# Altium project 定位NBIOT.PrjPCB
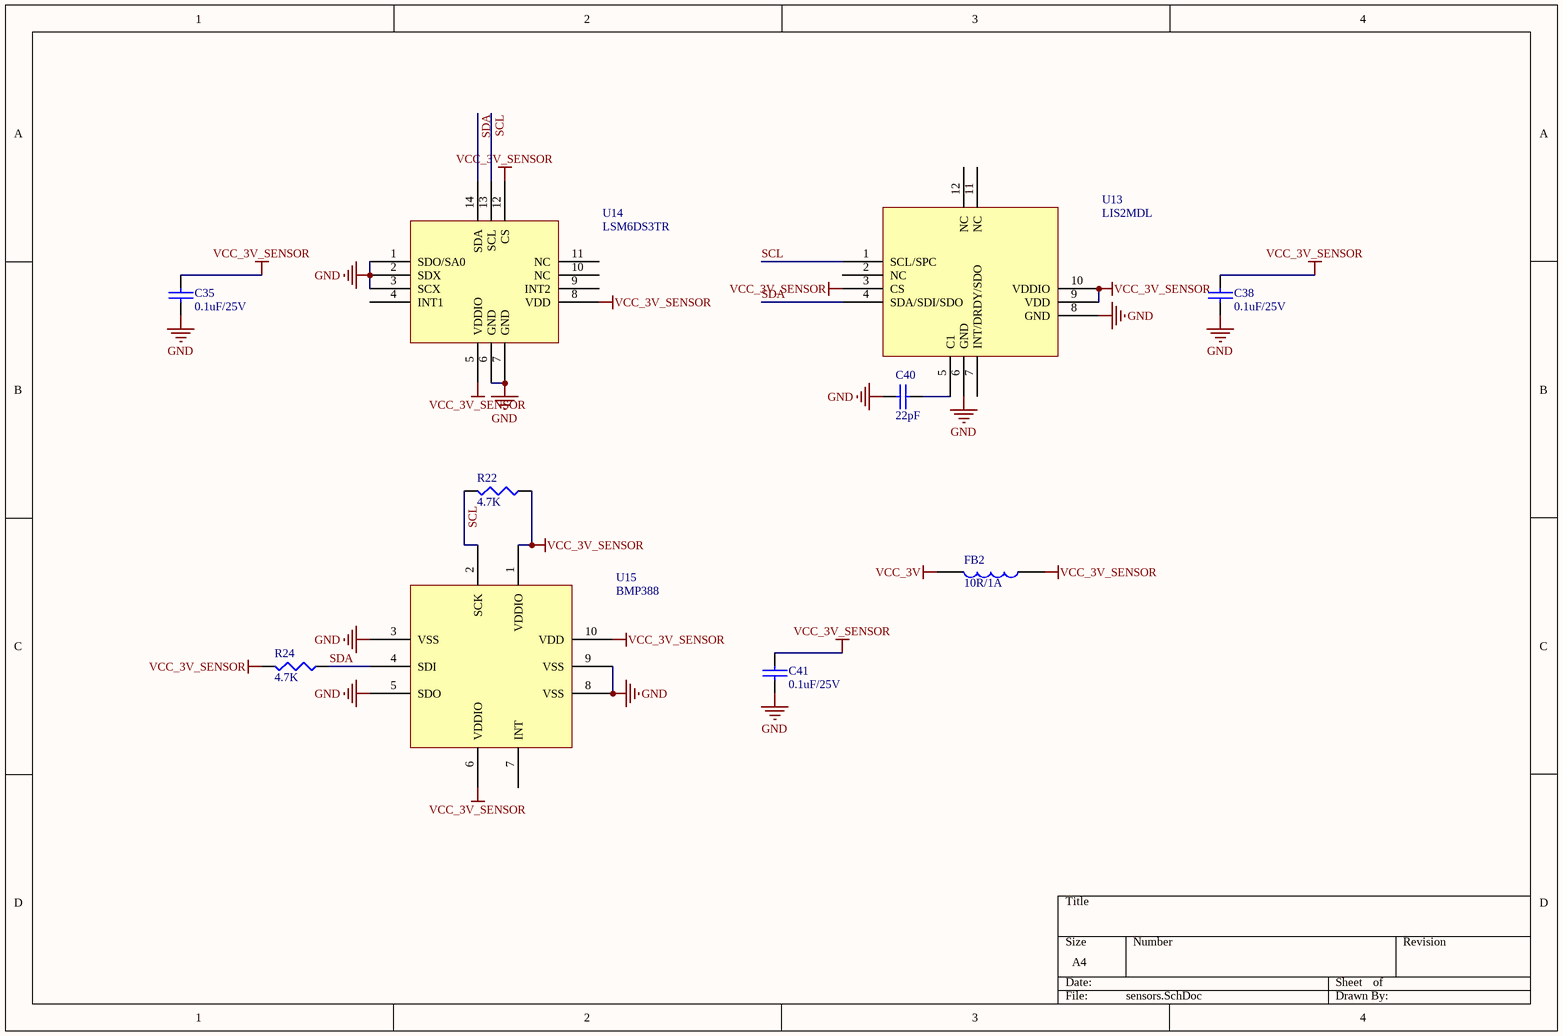
[diagram p0: sensors.SchDoc]
5 sheets, 117 parts. Net scope: global (net labels, ports and power ports of the same name join across sheets).
Board file: PCB1.2.PcbDoc
Sheets:
  sensors.SchDoc
  power.SchDoc
  4G.SchDoc
  GPS&&lte2.SchDoc
  NBIOT.SchDoc

## Sheet sensors.SchDoc
size A4

### Parts
C35  0.1uF/25V  [0402C]
C38  0.1uF/25V  [0402C]
C40  22pF  [0402c]
C41  0.1uF/25V  [0402C]
FB2  10R/1A  [0603R]
R22  4.7K  [0402R]
R24  4.7K  [0402R]
U13  LIS2MDL  [LIS2MDL]
U14  LSM6DS3TR  [LSM6DS3TR-C]
U15  BMP388  [BMP388]

### Nets
GND: C35.1 C38.1 C40.2 C41.1 U13.6(GND) U13.8(GND) U14.1(SDO/SA0) U14.2(SDX) U14.3(SCX) U14.6(GND) U14.7(GND) U15.3(VSS) U15.5(SDO) U15.8(VSS) U15.9(VSS)
VCC_3V: FB2.1
VCC_3V_SENSOR: C35.2 C38.2 C41.2 FB2.2 R22.1 R24.2 U13.3(CS) U13.9(VDD) U13.10(VDDIO) U14.5(VDDIO) U14.8(VDD) U14.12(CS) U15.1(VDDIO) U15.6(VDDIO) U15.10(VDD)
SCL: R22.2 U13.1(SCL/SPC) U14.13(SCL) U15.2(SCK)
SDA: R24.1 U13.4(SDA/SDI/SDO) U14.14(SDA) U15.4(SDI)
NetC40_1: C40.1 U13.5(C1)

Not connected (* = marked no-connect by the designer): U13 2(NC) 7(INT/DRDY/SDO) 11(NC) 12(NC); U14 4(INT1) 9(INT2) 10(NC) 11(NC); U15 7(INT)

### Library data of the parts
C35 C38 C40 C41 = CAP: Capacitor
FB2 = INDUCTOR1
R22 R24 = RES1: P: 1/8W

## Sheet power.SchDoc
size A3
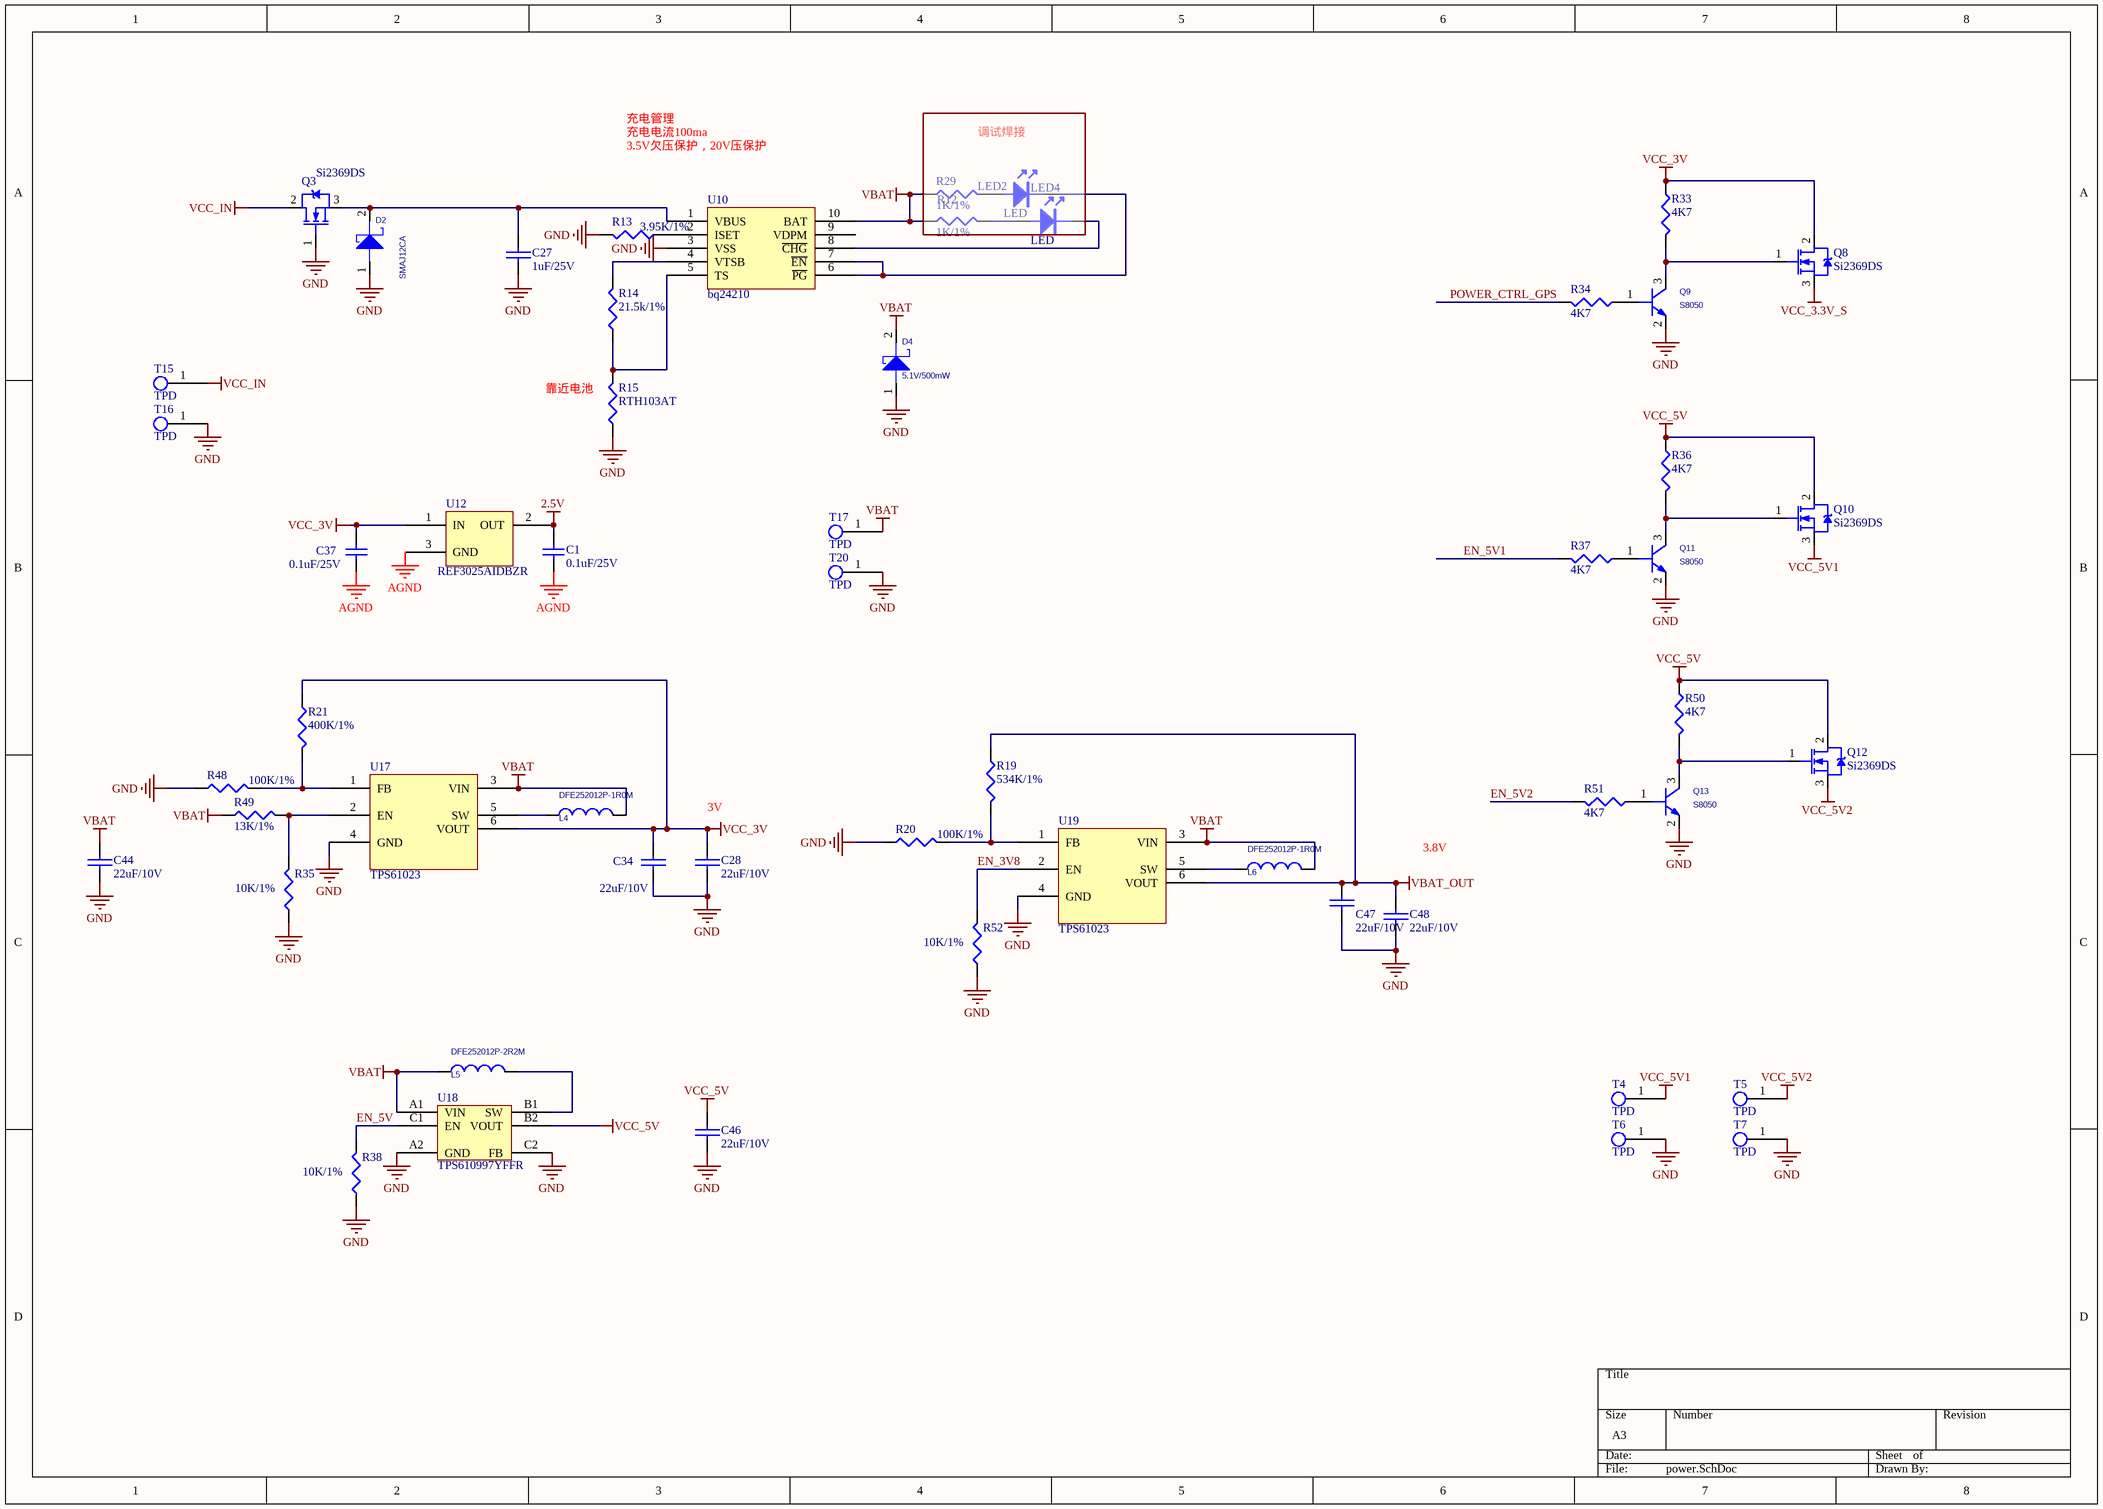
[diagram p1: power.SchDoc]

### Parts
C1  0.1uF/25V  [0402c]
C27  1uF/25V  [0402C]
C28  22uF/10V  [0805C]
C34  22uF/10V  [0805C]
C37  0.1uF/25V  [0402c]
C44  22uF/10V  [0805C]
C46  22uF/10V  [0805C]
C47  22uF/10V  [0805C]
C48  22uF/10V  [0805C]
D2  SMAJ12CA  [SMA]
D4  value 5.1V/500mW  [LL-34(D1206)]  (hidden comment: DIODE_SCHOTTKY_0)
L4  DFE252012P-1R0M  [L2520]
L5  DFE252012P-2R2M  [L2520]
L6  DFE252012P-1R0M  [L2520]
LED2  LED  [0603LED]
LED4  LED  [0603LED]
Q3  Si2369DS  [sot23-3]
Q8  Si2369DS  [sot23-3]
Q9  S8050  [SOT23-3]
Q10  Si2369DS  [sot23-3]
Q11  S8050  [SOT23-3]
Q12  Si2369DS  [sot23-3]
Q13  S8050  [SOT23-3]
R12  1K/1%  [0402R]
R13  3.95K/1%  [0402R]
R14  21.5k/1%  [0402R]
R15  RTH103AT  [0603R]
R19  534K/1%  [0402R]
R20  100K/1%  [0402R]
R21  400K/1%  [0402R]
R29  1K/1%  [0402R]
R33  4K7  [0402R]
R34  4K7  [0402R]
R35  10K/1%  [0402R]
R36  4K7  [0402R]
R37  4K7  [0402R]
R38  10K/1%  [0402R]
R48  100K/1%  [0402R]
R49  13K/1%  [0402R]
R50  4K7  [0402R]
R51  4K7  [0402R]
R52  10K/1%  [0402R]
T4  TPD  [TP]
T5  TPD  [TP]
T6  TPD  [TP]
T7  TPD  [TP]
T15  TPD  [TP]
T16  TPD  [TP]
T17  TPD  [TP]
T20  TPD  [TP]
U10  bq24210  [QFN50P200X300X80-10N]
U12  REF3025AIDBZR  [SOT23-3]
U17  TPS61023  [SOT563-6]
U18  TPS610997YFFR  [TPS610997YFFR]
U19  TPS61023  [SOT563-6]

### Blocks framed on the sheet
调试焊接: LED2 LED4 R12 R29

### Nets
2.5V: C1.1 U12.2(OUT)
AGND: C1.2 C37.2 U12.3(GND)
GND: C27.2 C28.2 C34.2 C44.2 C46.2 C47.2 C48.2 D2.1 D4.1 Q3.1(G) Q9.2(E) Q11.2(E) Q13.2(E) R13.2 R15.1 R20.1 R35.1 R38.1 R48.1 R52.1 T6.1 T7.1 T16.1 T20.1 U10.3(VSS) U17.4(GND) U18.A2(GND) U18.C2(FB) U19.4(GND)
VBAT: C44.1 D4.2 L4.2 L5.1 L6.2 R12.1 R29.1 R49.1 T17.1 U10.10(BAT) U17.3(VIN) U18.A1(VIN) U19.3(VIN)
VBAT_OUT: C47.1 C48.1 R19.1 U19.6(VOUT)
VCC_3.3V_S: Q8.3(S)
VCC_3V: C28.1 C34.1 C37.1 Q8.2(D) R21.1 R33.1 U12.1(IN) U17.6(VOUT)
VCC_5V: C46.1 Q10.2(D) Q12.2(D) R36.1 R50.1 U18.B2(VOUT)
VCC_5V1: Q10.3(S) T4.1
VCC_5V2: Q12.3(S) T5.1
VCC_IN: Q3.2(D) T15.1
EN_3V8: R52.2 U19.2(EN)
EN_5V: R38.2 U18.C1(EN)
EN_5V1: R37.2
EN_5V2: R51.2
POWER_CTRL_GPS: R34.2
NetC27_1: C27.1 D2.2 Q3.3(S) U10.1(VBUS)
NetL4_1: L4.1 U17.5(SW)
NetL5_2: L5.2 U18.B1(SW)
NetL6_1: L6.1 U19.5(SW)
NetLED2_1: LED2.1 R29.2
NetLED2_2: LED2.2 U10.6(~{PG}) U10.7(~{EN})
NetLED4_1: LED4.1 R12.2
NetLED4_2: LED4.2 U10.8(~{CHG})
NetQ8_1: Q8.1(G) Q9.3(C) R33.2
NetQ9_1: Q9.1(B) R34.1
NetQ10_1: Q10.1(G) Q11.3(C) R36.2
NetQ11_1: Q11.1(B) R37.1
NetQ12_1: Q12.1(G) Q13.3(C) R50.2
NetQ13_1: Q13.1(B) R51.1
NetR13_1: R13.1 U10.2(ISET)
NetR14_1: R14.1 R15.2 U10.5(TS)
NetR14_2: R14.2 U10.4(VTSB)
NetR19_2: R19.2 R20.2 U19.1(FB)
NetR21_2: R21.2 R48.2 U17.1(FB)
NetR35_2: R35.2 R49.2 U17.2(EN)

Not connected (* = marked no-connect by the designer): U10 9(VDPM)

### Notes on the sheet
- 充电管理
- 充电电流100ma
- 3.5V欠压保护，20V压保护
- (near R15) 靠近电池
- (near C28) 3V
- 3.8V

### Library data of the parts
C1 C37 = Cap: Capacitor; Value: 0.1uF; Published: 8-Jun-2000; LatestRevisionDate: 17-Jul-2002; LatestRevisionNote: Re-released for DXP Platform.; PackageReference: RAD-0.3; Publisher: Altium Limited; PackageDescription: Radial Cap, Thru-Hole; 2 Leads; 0.3 in Pin Spacing
C27 C28 C34 C44 C46-C48 = CAP: Capacitor
D2 D4 = DIODE_SCHOTTKY_0: PCB DECAL: DO_214AC; Source_Path: E:\AIH\WORK\A\LIBRARY1.OLB
  D2: Value: SMAJ12CA
L4-L6 = INDUCTOR_1
Q3 Q8 Q10 Q12 = NCE4060K: NMOSFET
Q9 Q11 Q13 = 2N1069_1: PspiceTemplate: Q^@REFDES %C %B %E
R12-R15 R19-R21 R29 R33-R38 R48-R52 = RES1: P: 1/8W
U10 = bq2410
U12 = REF3012

## Sheet 4G.SchDoc
size A2

## Sheet GPS&&lte2.SchDoc
size A2
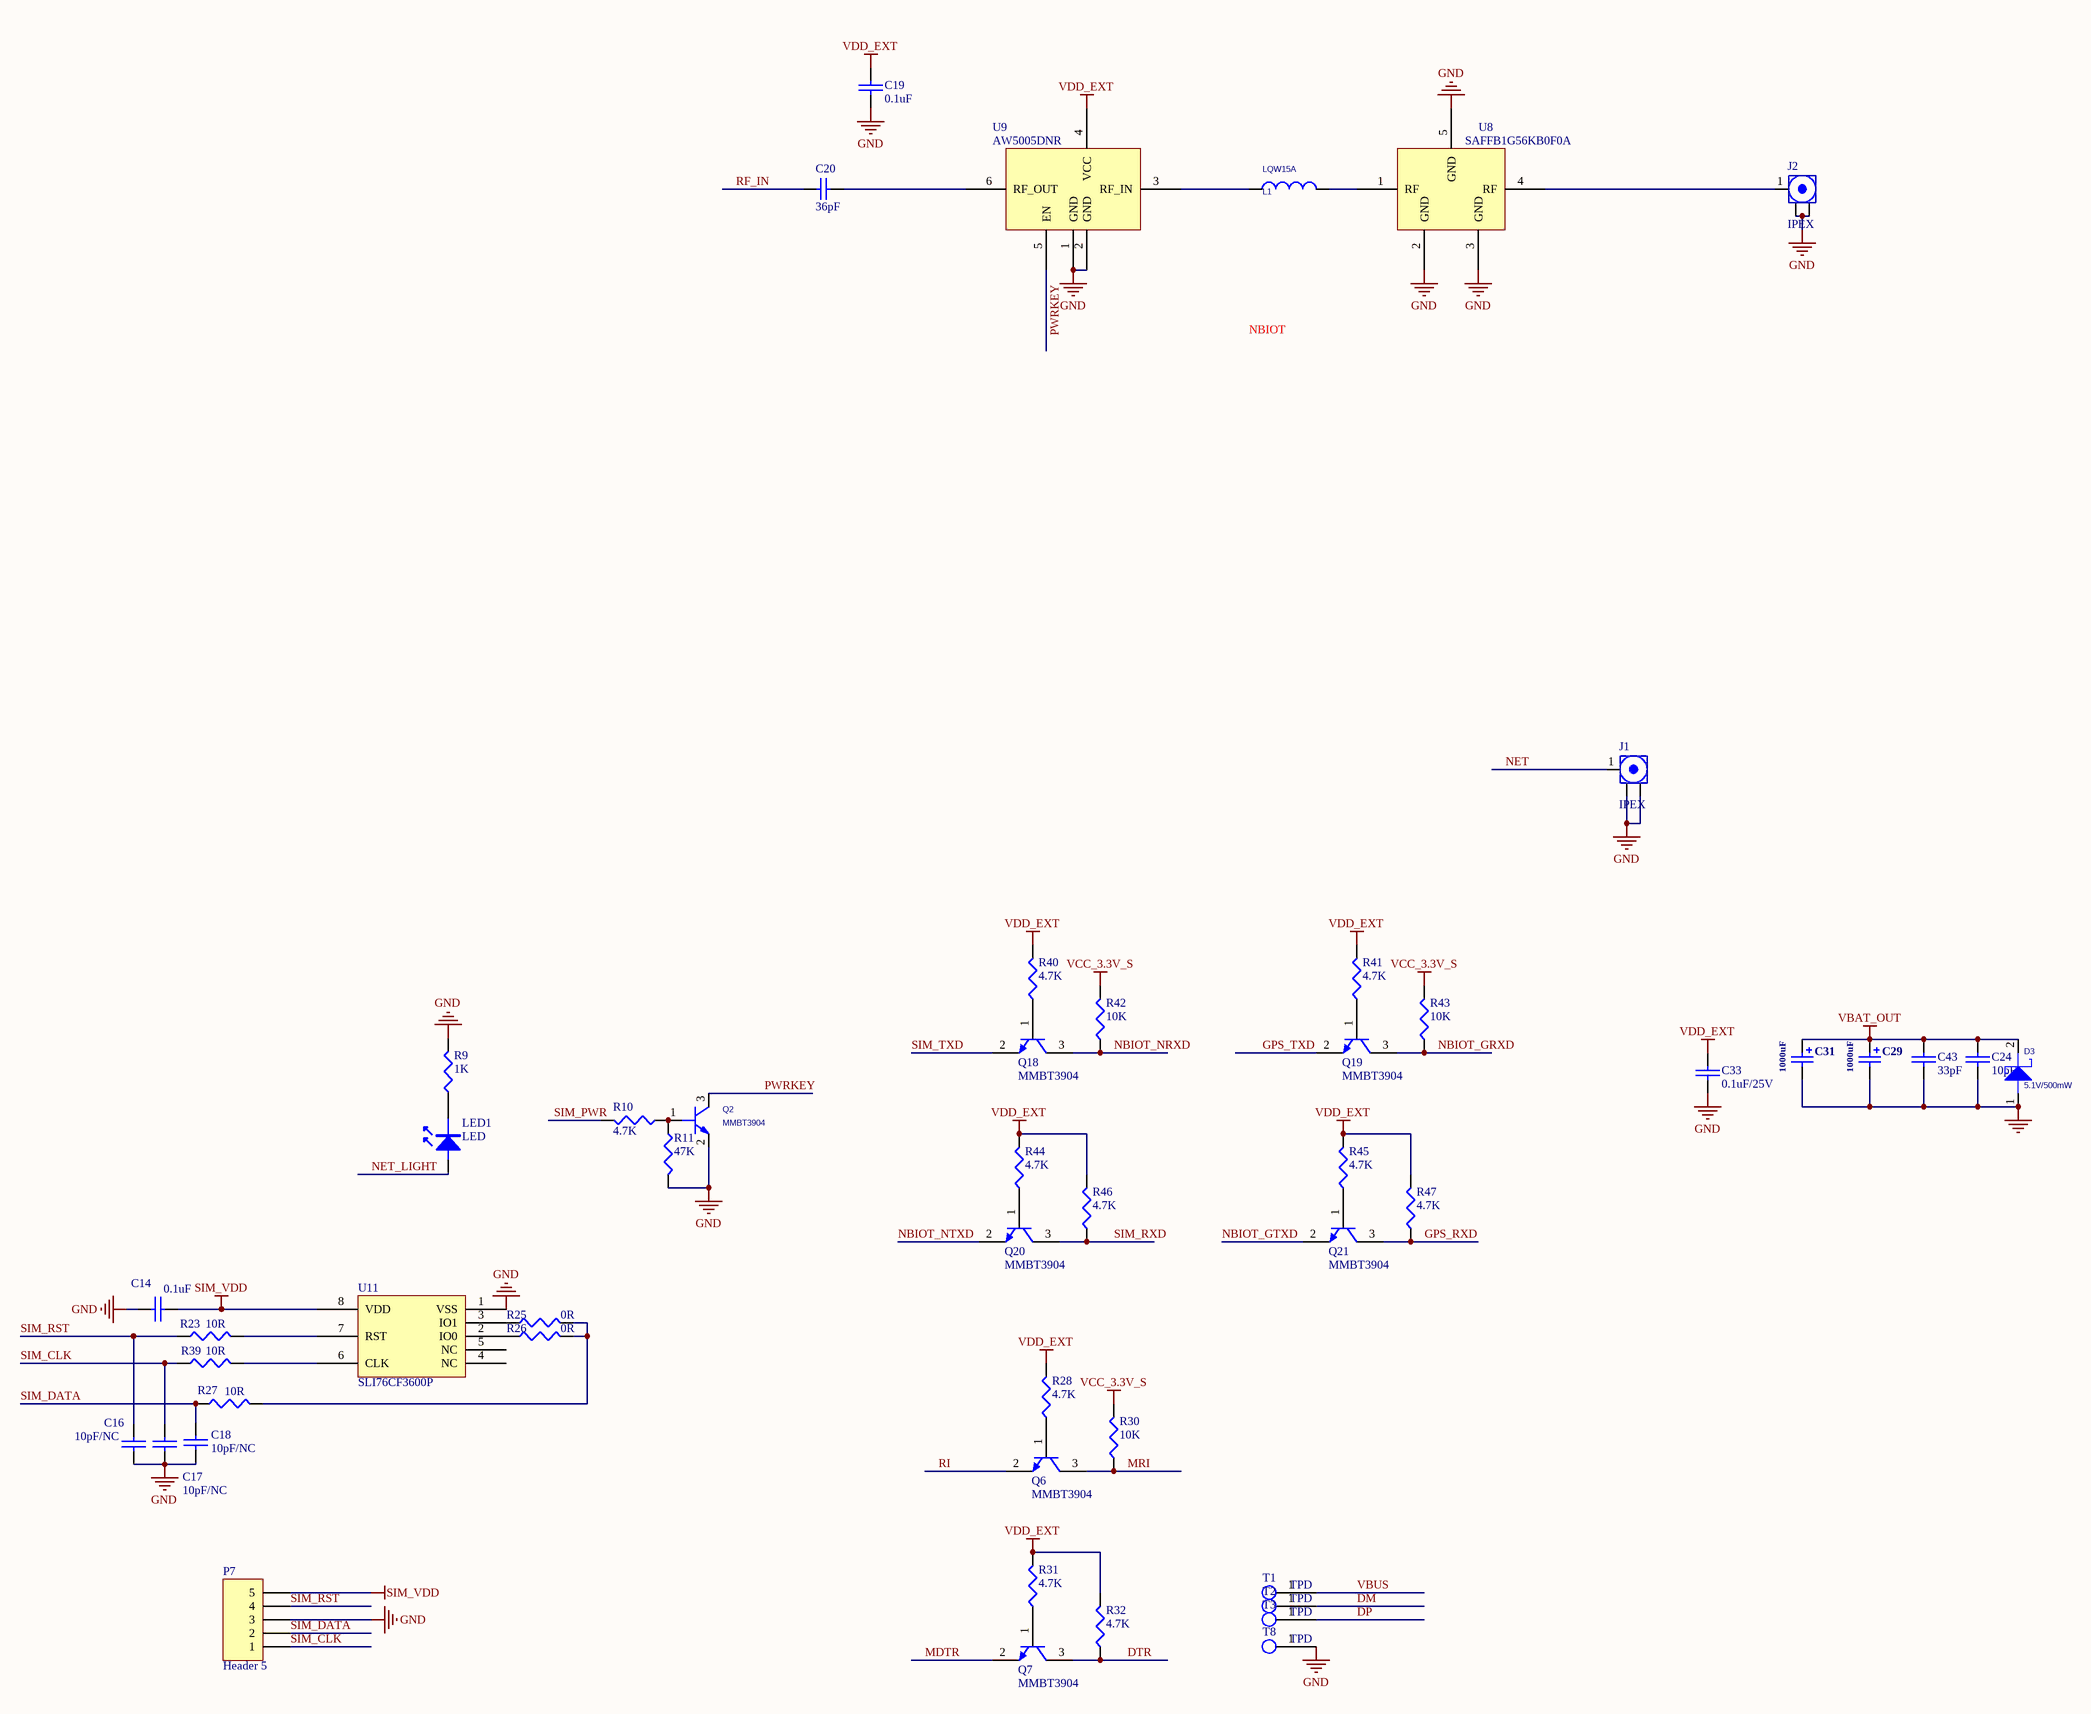
[diagram p2: GPS&&lte2.SchDoc]

### Parts
C14  0.1uF  [0402C]
C16  10pF/NC  [0402C]
C17  10pF/NC  [0402C]
C18  10pF/NC  [0402C]
C19  0.1uF  [0402C]
C20  36pF  [0402c]
C24  10pF  [0402C]
C29  1000uF  [7343]
C31  1000uF  [7343]
C33  0.1uF/25V  [0402C]
C43  33pF  [0402C]
D3  value 5.1V/500mW  [LL-34(D1206)]  (hidden comment: DIODE_SCHOTTKY_0)
J1  IPEX  [RF-UFL]
J2  IPEX  [RF-UFL]
L1  LQW15A  [0402R]
LED1  LED  [0603LED]
P7  Header 5  [5×1.25mmSMT]
Q2  MMBT3904  [SOT23-3]
Q6  MMBT3904  [SOT23-3]
Q7  MMBT3904  [SOT23-3]
Q18  MMBT3904  [SOT23-3]
Q19  MMBT3904  [SOT23-3]
Q20  MMBT3904  [SOT23-3]
Q21  MMBT3904  [SOT23-3]
R9  1K  [0402R]
R10  4.7K  [0402R]
R11  47K  [0402R]
R23  10R  [0402R]
R25  0R  [0402R]
R26  0R  [0402R]
R27  10R  [0402R]
R28  4.7K  [0402R]
R30  10K  [0402R]
R31  4.7K  [0402R]
R32  4.7K  [0402R]
R39  10R  [0402R]
R40  4.7K  [0402R]
R41  4.7K  [0402R]
R42  10K  [0402R]
R43  10K  [0402R]
R44  4.7K  [0402R]
R45  4.7K  [0402R]
R46  4.7K  [0402R]
R47  4.7K  [0402R]
T1  TPD  [TPD]
T2  TPD  [TPD]
T3  TPD  [TPD]
T8  TPD  [TPD]
U8  SAFFB1G56KB0F0A  [SAFFB1G56KB0F0A]
U9  AW5005DNR  [AW5005]
U11  SLI76CF3600P  [QFN127P500X600X80-8N]

### Nets
GND: C14.1 C16.1 C17.1 C18.1 C19.1 C24.1 C29.2 C31.2 C33.1 C43.1 D3.1 J1.2(Y) J2.2(Y) P7.3 Q2.2(E) R9.2 R11.2 T8.1 U8.2(GND) U8.3(GND) U8.5(GND) U9.1(GND) U9.2(GND) U11.1(VSS)
SIM_VDD: C14.2 P7.5 U11.8(VDD)
VBAT_OUT: C24.2 C29.1 C31.1 C43.2 D3.2
VCC_3.3V_S: R30.2 R42.2 R43.2
VDD_EXT: C19.2 C33.2 R28.2 R31.2 R32.2 R40.2 R41.2 R44.2 R45.2 R46.2 R47.2 U9.4(VCC)
DM: T2.1
DP: T3.1
DTR: Q7.3(C) R32.1
GPS_RXD: Q21.3(C) R47.1
GPS_TXD: Q19.2(E)
MDTR: Q7.2(E)
MRI: Q6.3(C) R30.1
NBIOT_GRXD: Q19.3(C) R43.1
NBIOT_GTXD: Q21.2(E)
NBIOT_NRXD: Q18.3(C) R42.1
NBIOT_NTXD: Q20.2(E)
NET: J1.1(X)
NET_LIGHT: LED1.1
PWRKEY: Q2.3(C) U9.5(EN)
RF_IN: C20.1
RI: Q6.2(E)
SIM_CLK: C17.2 P7.1 R39.1
SIM_DATA: C18.2 P7.2 R27.1
SIM_PWR: R10.2
SIM_RST: C16.2 P7.4 R23.1
SIM_RXD: Q20.3(C) R46.1
SIM_TXD: Q18.2(E)
VBUS: T1.1
NetC20_2: C20.2 U9.6(RF_OUT)
NetJ2_1: J2.1(X) U8.4(RF)
NetL1_1: L1.1 U9.3(RF_IN)
NetL1_2: L1.2 U8.1(RF)
NetLED1_2: LED1.2 R9.1
NetQ2_1: Q2.1(B) R10.1 R11.1
NetQ6_1: Q6.1(B) R28.1
NetQ7_1: Q7.1(B) R31.1
NetQ18_1: Q18.1(B) R40.1
NetQ19_1: Q19.1(B) R41.1
NetQ20_1: Q20.1(B) R44.1
NetQ21_1: Q21.1(B) R45.1
NetR23_2: R23.2 U11.7(RST)
NetR25_1: R25.1 U11.3(IO1)
NetR25_2: R25.2 R26.2 R27.2
NetR26_1: R26.1 U11.2(IO0)
NetR39_2: R39.2 U11.6(CLK)

Not connected (* = marked no-connect by the designer): U11 4(NC) 5(NC)

### Notes on the sheet
- NBIOT

### Library data of the parts
C14 C16-C19 C24 C33 C43 = CAP: Capacitor
C20 = Cap: Capacitor; Value: 0.1uF/10V; Published: 8-Jun-2000; LatestRevisionDate: 17-Jul-2002; LatestRevisionNote: Re-released for DXP Platform.; PackageReference: RAD-0.3; Publisher: Altium Limited
C29 C31 = Cap Pol3: Polarized Capacitor (Surface Mount); PackageReference: C10*10.2
D3 = DIODE_SCHOTTKY_0: as D2 on sheet power
J1 J2 = ANT
L1 = INDUCTOR_1
P7 = Header 5: Header, 5-Pin; LatestRevisionDate: 17-Jul-2002; LatestRevisionNote: Re-released for DXP Platform.; Publisher: Altium Limited
Q2 = 2N1069_1: PspiceTemplate: Q^@REFDES %C %B %E
Q6 Q7 Q18-Q21 = NPN
R9-R11 R23 R25-R28 R30-R32 R39-R47 = RES1: P: 1/8W
U8 = SAFFB1G56KBOFA

## Sheet NBIOT.SchDoc
size A3
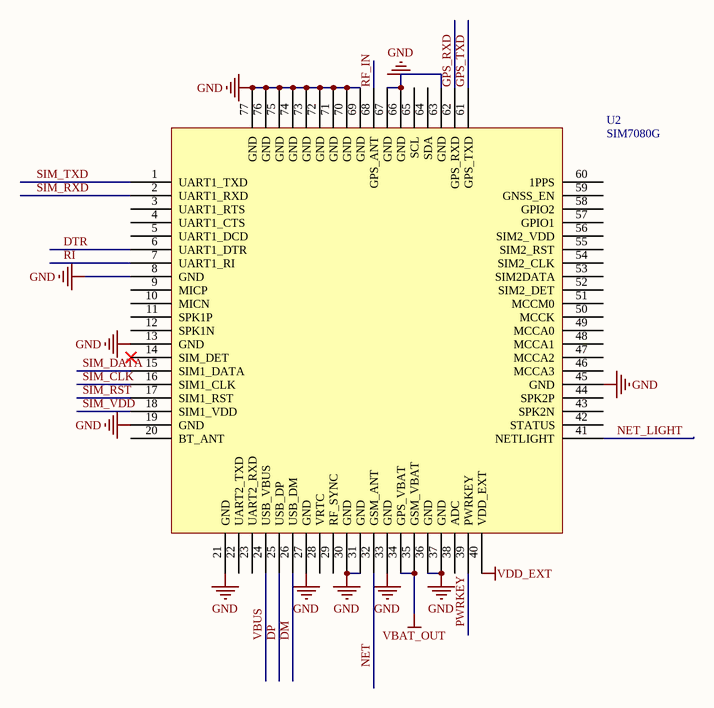
[diagram p3: NBIOT.SchDoc]

### Parts
U2  SIM7080G  [SIM868]

### Nets
GND: U2.8(GND) U2.13(GND) U2.19(GND) U2.21(GND) U2.27(GND) U2.30(GND) U2.31(GND) U2.33(GND) U2.36(GND) U2.37(GND) U2.45(GND) U2.63(GND) U2.66(GND) U2.67(GND) U2.69(GND) U2.70(GND) U2.71(GND) U2.72(GND) U2.73(GND) U2.74(GND) U2.75(GND) U2.76(GND) U2.77(GND)
SIM_VDD: U2.18(SIM1_VDD)
VBAT_OUT: U2.34(GPS_VBAT) U2.35(GSM_VBAT)
VDD_EXT: U2.40(VDD_EXT)
DM: U2.26(USB_DM)
DP: U2.25(USB_DP)
DTR: U2.6(UART1_DTR)
GPS_RXD: U2.62(GPS_RXD)
GPS_TXD: U2.61(GPS_TXD)
NET: U2.32(GSM_ANT)
NET_LIGHT: U2.41(NETLIGHT)
PWRKEY: U2.39(PWRKEY)
RF_IN: U2.68(GPS_ANT)
RI: U2.7(UART1_RI)
SIM_CLK: U2.16(SIM1_CLK)
SIM_DATA: U2.15(SIM1_DATA)
SIM_RST: U2.17(SIM1_RST)
SIM_RXD: U2.2(UART1_RXD)
SIM_TXD: U2.1(UART1_TXD)
VBUS: U2.24(USB_VBUS)

Not connected (* = marked no-connect by the designer): U2 3(UART1_RTS) 4(UART1_CTS) 5(UART1_DCD) 9(MICP) 10(MICN) 11(SPK1P) 12(SPK1N) 14(SIM_DET)* 20(BT_ANT) 22(UART2_TXD) 23(UART2_RXD) 28(VRTC) 29(RF_SYNC) 38(ADC) 42(STATUS) 43(SPK2N) 44(SPK2P) 46(MCCA3) 47(MCCA2) 48(MCCA1) 49(MCCA0) 50(MCCK) 51(MCCM0) 52(SIM2_DET) 53(SIM2DATA) 54(SIM2_CLK) 55(SIM2_RST) 56(SIM2_VDD) 57(GPIO1) 58(GPIO2) 59(GNSS_EN) 60(1PPS) 64(SDA) 65(SCL)

### Library data of the parts
U2 = SIM868E/SIM868

## Nets that join several sheets
GND: sensors (15 pins), power (29 pins), GPS&&lte2 (24 pins), NBIOT (23 pins)
SIM_VDD: GPS&&lte2 (C14.2 P7.5 U11.8), NBIOT (U2.18)
VBAT_OUT: power (C47.1 C48.1 R19.1 U19.6), GPS&&lte2 (5 pins), NBIOT (U2.34 U2.35)
VCC_3.3V_S: power (Q8.3), GPS&&lte2 (R30.2 R42.2 R43.2)
VCC_3V: sensors (FB2.1), power (8 pins)
VDD_EXT: GPS&&lte2 (12 pins), NBIOT (U2.40)
DM: GPS&&lte2 (T2.1), NBIOT (U2.26)
DP: GPS&&lte2 (T3.1), NBIOT (U2.25)
DTR: GPS&&lte2 (Q7.3 R32.1), NBIOT (U2.6)
GPS_RXD: GPS&&lte2 (Q21.3 R47.1), NBIOT (U2.62)
GPS_TXD: GPS&&lte2 (Q19.2), NBIOT (U2.61)
NET: GPS&&lte2 (J1.1), NBIOT (U2.32)
NET_LIGHT: GPS&&lte2 (LED1.1), NBIOT (U2.41)
PWRKEY: GPS&&lte2 (Q2.3 U9.5), NBIOT (U2.39)
RF_IN: GPS&&lte2 (C20.1), NBIOT (U2.68)
RI: GPS&&lte2 (Q6.2), NBIOT (U2.7)
SIM_CLK: GPS&&lte2 (C17.2 P7.1 R39.1), NBIOT (U2.16)
SIM_DATA: GPS&&lte2 (C18.2 P7.2 R27.1), NBIOT (U2.15)
SIM_RST: GPS&&lte2 (C16.2 P7.4 R23.1), NBIOT (U2.17)
SIM_RXD: GPS&&lte2 (Q20.3 R46.1), NBIOT (U2.2)
SIM_TXD: GPS&&lte2 (Q18.2), NBIOT (U2.1)
VBUS: GPS&&lte2 (T1.1), NBIOT (U2.24)